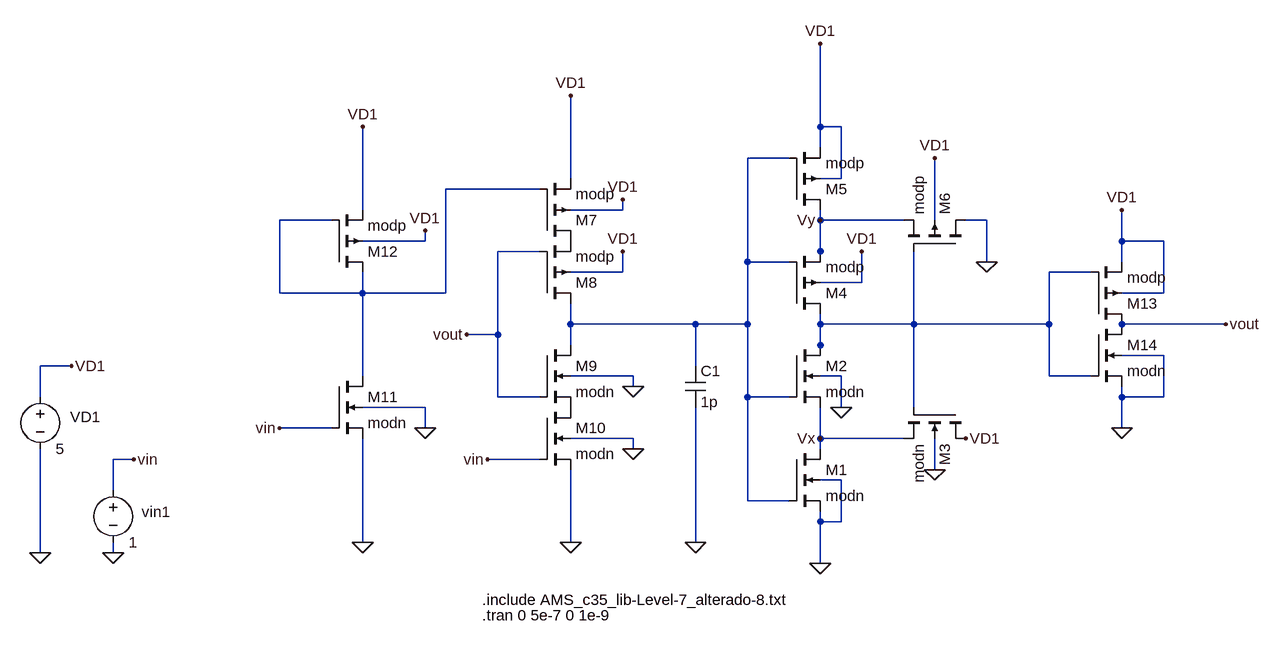
[diagram p0: schematic VCO-final.asc]
VCO-final.asc, the LTspice schematic file:
Version 4
SHEET 1 880 680
WIRE -704 -1152 -704 -1280
WIRE -672 -1152 -704 -1152
WIRE -704 -1120 -704 -1152
WIRE -752 -1104 -816 -1104
WIRE -1088 -1072 -1088 -1200
WIRE -672 -1072 -672 -1152
WIRE -672 -1072 -704 -1072
WIRE -1136 -1056 -1280 -1056
WIRE -1408 -1024 -1408 -1152
WIRE -1008 -1024 -1008 -1040
WIRE -1008 -1024 -1088 -1024
WIRE -1456 -1008 -1536 -1008
WIRE -704 -1008 -704 -1024
WIRE -576 -1008 -704 -1008
WIRE -528 -1008 -528 -1104
WIRE -448 -1008 -480 -1008
WIRE -1312 -976 -1312 -992
WIRE -1312 -976 -1408 -976
WIRE -240 -976 -240 -1024
WIRE -176 -976 -240 -976
WIRE -1136 -960 -1200 -960
WIRE -704 -960 -704 -1008
WIRE -816 -944 -816 -1104
WIRE -752 -944 -816 -944
WIRE -704 -944 -704 -960
WIRE -448 -944 -448 -1008
WIRE -240 -944 -240 -976
WIRE -1008 -928 -1008 -960
WIRE -1008 -928 -1088 -928
WIRE -288 -928 -352 -928
WIRE -640 -912 -640 -960
WIRE -640 -912 -704 -912
WIRE -1536 -896 -1536 -1008
WIRE -1408 -896 -1408 -928
WIRE -1408 -896 -1536 -896
WIRE -1280 -896 -1280 -1056
WIRE -1280 -896 -1408 -896
WIRE -176 -896 -176 -976
WIRE -176 -896 -240 -896
WIRE -1088 -848 -1088 -880
WIRE -896 -848 -1088 -848
WIRE -816 -848 -816 -944
WIRE -816 -848 -896 -848
WIRE -704 -848 -704 -864
WIRE -560 -848 -560 -960
WIRE -560 -848 -704 -848
WIRE -352 -848 -352 -928
WIRE -352 -848 -560 -848
WIRE -80 -848 -240 -848
WIRE -1200 -832 -1200 -960
WIRE -1200 -832 -1248 -832
WIRE -1088 -816 -1088 -848
WIRE -704 -816 -704 -848
WIRE -704 -800 -704 -816
WIRE -176 -800 -240 -800
WIRE -1856 -784 -1904 -784
WIRE -896 -784 -896 -848
WIRE -1408 -768 -1408 -896
WIRE -992 -768 -1088 -768
WIRE -672 -768 -704 -768
WIRE -352 -768 -352 -848
WIRE -288 -768 -352 -768
WIRE -992 -752 -992 -768
WIRE -1904 -736 -1904 -784
WIRE -1200 -736 -1200 -832
WIRE -1136 -736 -1200 -736
WIRE -816 -736 -816 -848
WIRE -752 -736 -816 -736
WIRE -240 -736 -240 -752
WIRE -176 -736 -176 -800
WIRE -176 -736 -240 -736
WIRE -1312 -720 -1408 -720
WIRE -672 -720 -672 -768
WIRE -560 -720 -560 -848
WIRE -1456 -688 -1536 -688
WIRE -1312 -688 -1312 -720
WIRE -240 -688 -240 -736
WIRE -992 -672 -1088 -672
WIRE -704 -672 -704 -720
WIRE -576 -672 -704 -672
WIRE -992 -656 -992 -672
WIRE -704 -656 -704 -672
WIRE -1760 -640 -1792 -640
WIRE -1136 -640 -1216 -640
WIRE -528 -624 -528 -672
WIRE -672 -608 -704 -608
WIRE -1792 -592 -1792 -640
WIRE -816 -576 -816 -736
WIRE -752 -576 -816 -576
WIRE -704 -544 -704 -560
WIRE -672 -544 -672 -608
WIRE -672 -544 -704 -544
WIRE -1408 -512 -1408 -672
WIRE -1088 -512 -1088 -624
WIRE -896 -512 -896 -720
WIRE -1904 -496 -1904 -656
WIRE -1792 -496 -1792 -512
WIRE -704 -480 -704 -544
FLAG -1904 -496 0
FLAG -1856 -784 VD1
FLAG -1792 -496 0
FLAG -1760 -640 vin
FLAG -704 -480 0
FLAG -672 -720 0
FLAG -528 -624 0
FLAG -480 -672 VD1
FLAG -704 -672 Vx
FLAG -704 -1280 VD1
FLAG -448 -944 0
FLAG -528 -1104 VD1
FLAG -640 -960 VD1
FLAG -704 -1008 Vy
FLAG -1408 -512 0
FLAG -240 -688 0
FLAG -240 -1024 VD1
FLAG -1008 -1040 VD1
FLAG -1008 -960 VD1
FLAG -992 -752 0
FLAG -992 -656 0
FLAG -1088 -1200 VD1
FLAG -1088 -512 0
FLAG -1408 -1152 VD1
FLAG -1312 -992 VD1
FLAG -1312 -688 0
FLAG -80 -848 vout
FLAG -1536 -688 vin
FLAG -1216 -640 vin
FLAG -1248 -832 vout
FLAG -896 -512 0
SYMBOL voltage -1904 -752 R0
WINDOW 0 46 47 Left 2
WINDOW 123 0 0 Left 2
WINDOW 39 0 0 Left 2
SYMATTR InstName VD1
SYMATTR Value 5
SYMBOL voltage -1792 -608 R0
WINDOW 0 44 49 Left 2
WINDOW 123 0 0 Left 2
WINDOW 39 0 0 Left 2
SYMATTR InstName vin1
SYMATTR Value 1
SYMBOL nmos4 -752 -656 R0
SYMATTR InstName M1
SYMATTR Value modn
SYMATTR Value2 l=2.4u w=2.4u
SYMBOL nmos4 -752 -816 R0
SYMATTR InstName M2
SYMATTR Value modn
SYMATTR Value2 l=2.4u w=2.4u
SYMBOL nmos4 -480 -720 R90
SYMATTR InstName M3
SYMATTR Value modn
SYMATTR Value2 l=2.8u w=6.6u
SYMBOL pmos4 -752 -864 M180
SYMATTR InstName M4
SYMATTR Value modp
SYMATTR Value2 l=1.2u w=4.8u
SYMBOL pmos4 -752 -1024 M180
SYMATTR InstName M5
SYMATTR Value modp
SYMATTR Value2 l=1.2u w=4.8u
SYMBOL pmos4 -480 -960 M270
SYMATTR InstName M6
SYMATTR Value modp
SYMATTR Value2 l=1.2u w=10.8u
SYMBOL pmos4 -1136 -976 M180
SYMATTR InstName M7
SYMATTR Value modp
SYMATTR Value2 l=0.5u w=10u
SYMBOL pmos4 -1136 -880 M180
SYMATTR InstName M8
SYMATTR Value modp
SYMATTR Value2 l=0.5u w=10u
SYMBOL nmos4 -1136 -816 R0
SYMATTR InstName M9
SYMATTR Value modn
SYMATTR Value2 l=0.5u w=4u
SYMBOL nmos4 -1136 -720 R0
SYMATTR InstName M10
SYMATTR Value modn
SYMATTR Value2 l=0.5u w=4u
SYMBOL nmos4 -1456 -768 R0
SYMATTR InstName M11
SYMATTR Value modn
SYMATTR Value2 l=0.5u w=10u
SYMBOL pmos4 -1456 -928 M180
SYMATTR InstName M12
SYMATTR Value modp
SYMATTR Value2 l=0.5u w=10u
SYMBOL pmos4 -288 -848 M180
SYMATTR InstName M13
SYMATTR Value modp
SYMATTR Value2 l=0.5u w=10u
SYMBOL nmos4 -288 -848 R0
SYMATTR InstName M14
SYMATTR Value modn
SYMATTR Value2 l=0.5u w=10u
SYMBOL cap -912 -784 R0
SYMATTR InstName C1
SYMATTR Value 1p
TEXT -1224 -424 Left 2 !.include AMS_c35_lib-Level-7_alterado-8.txt
TEXT -1224 -400 Left 2 !.tran 0 5e-7 0 1e-9

The netlist it stands for:
* VCO-final.asc
VD1 VD1 0 5
vin1 vin 0 1
M1 Vx N001 0 0 modn l=2.4u w=2.4u
M2 N003 N001 Vx 0 modn l=2.4u w=2.4u
M3 VD1 N003 Vx 0 modn l=2.8u w=6.6u
M4 N003 N001 Vy VD1 modp l=1.2u w=4.8u
M5 Vy N001 VD1 VD1 modp l=1.2u w=4.8u
M6 0 N003 Vy VD1 modp l=1.2u w=10.8u
M7 P001 N002 VD1 VD1 modp l=0.5u w=10u
M8 N001 vout P001 VD1 modp l=0.5u w=10u
M9 N001 vout P002 0 modn l=0.5u w=4u
M10 P002 vin 0 0 modn l=0.5u w=4u
M11 N002 vin 0 0 modn l=0.5u w=10u
M12 N002 N002 VD1 VD1 modp l=0.5u w=10u
M13 vout N003 VD1 VD1 modp l=0.5u w=10u
M14 vout N003 0 0 modn l=0.5u w=10u
C1 N001 0 1p
.model NMOS NMOS
.model PMOS PMOS
.lib standard.mos
.include AMS_c35_lib-Level-7_alterado-8.txt
.tran 0 5e-7 0 1e-9
.backanno
.end